# EAGLE design MasterBoard (EAGLE 9.4.2)
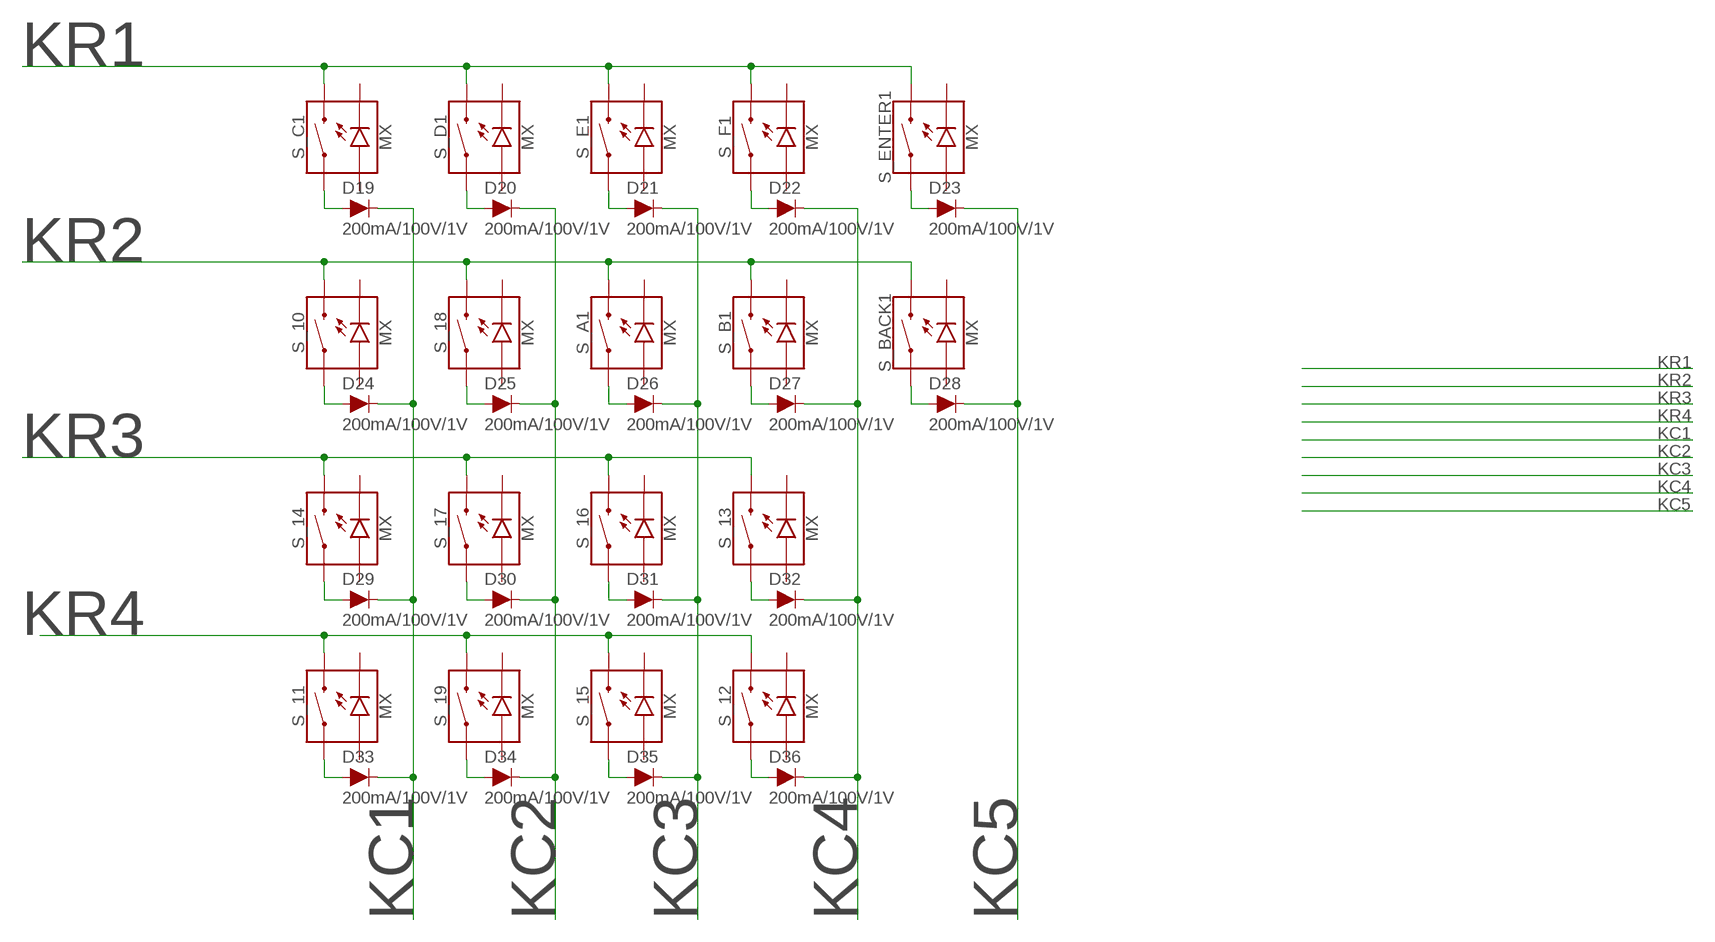
[diagram p0: schematic, sheet 1, part 1 of 2]
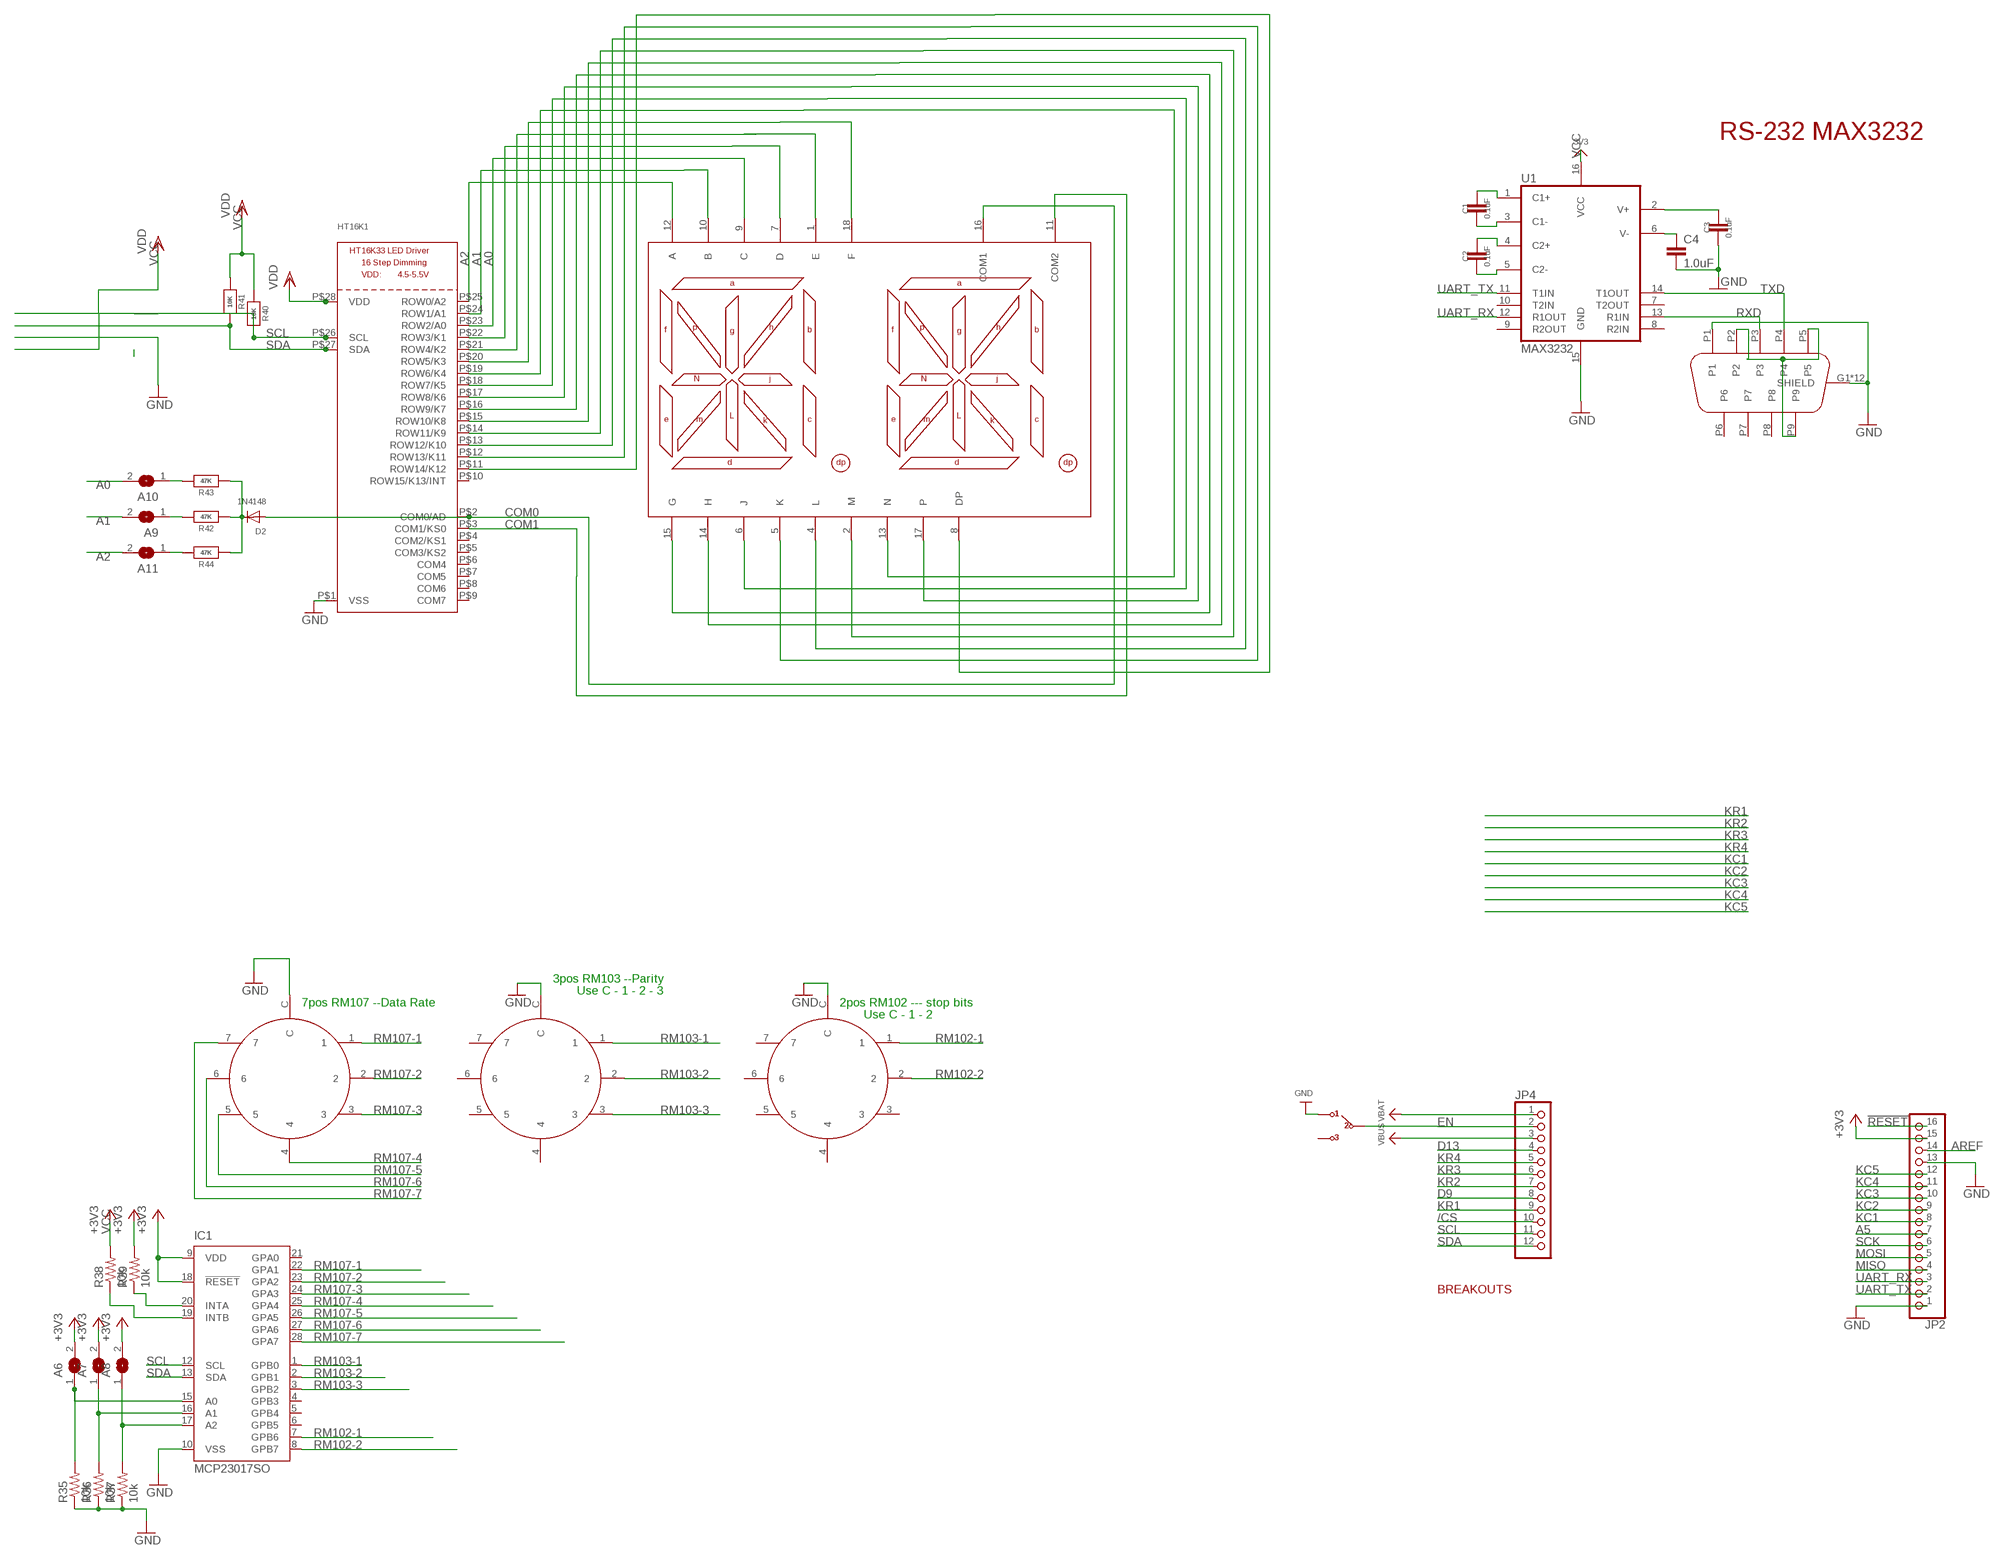
[diagram p1: schematic, sheet 1, part 2 of 2]

## Parts
A6  SJ  [SJ]
A7  SJ  [SJ]
A8  SJ  [SJ]
A9  SOLDERJUMPERREFLOW_NOPASTE  [SOLDERJUMPER_REFLOW_NOPASTE]
A10  SOLDERJUMPERREFLOW_NOPASTE  [SOLDERJUMPER_REFLOW_NOPASTE]
A11  SOLDERJUMPERREFLOW_NOPASTE  [SOLDERJUMPER_REFLOW_NOPASTE]
C1  0.1uF  1.0UF-0805-25V-10%  [0805]
C2  0.1uF  1.0UF-0805-25V-10%  [0805]
C3  0.1uF  1.0UF-0805-25V-10%  [0805]
C4  1.0uF  1.0UF-0805-25V-10%  [0805]
D2  1N4148  DIODESOD-323F  [SOD-323F]
D19  200mA/100V/1V  DIODE-1N4148  [DIODE-1N4148]
D20  200mA/100V/1V  DIODE-1N4148  [DIODE-1N4148]
D21  200mA/100V/1V  DIODE-1N4148  [DIODE-1N4148]
D22  200mA/100V/1V  DIODE-1N4148  [DIODE-1N4148]
D23  200mA/100V/1V  DIODE-1N4148  [DIODE-1N4148]
D24  200mA/100V/1V  DIODE-1N4148  [DIODE-1N4148]
D25  200mA/100V/1V  DIODE-1N4148  [DIODE-1N4148]
D26  200mA/100V/1V  DIODE-1N4148  [DIODE-1N4148]
D27  200mA/100V/1V  DIODE-1N4148  [DIODE-1N4148]
D28  200mA/100V/1V  DIODE-1N4148  [DIODE-1N4148]
D29  200mA/100V/1V  DIODE-1N4148  [DIODE-1N4148]
D30  200mA/100V/1V  DIODE-1N4148  [DIODE-1N4148]
D31  200mA/100V/1V  DIODE-1N4148  [DIODE-1N4148]
D32  200mA/100V/1V  DIODE-1N4148  [DIODE-1N4148]
D33  200mA/100V/1V  DIODE-1N4148  [DIODE-1N4148]
D34  200mA/100V/1V  DIODE-1N4148  [DIODE-1N4148]
D35  200mA/100V/1V  DIODE-1N4148  [DIODE-1N4148]
D36  200mA/100V/1V  DIODE-1N4148  [DIODE-1N4148]
DE9FEMALE1  EDGEMOUNTDE9  [DE09S065TLF]
HT16K1  HT16K33_SOP28_SKINNY  [SOP28_300MIL_SKINNY]
IC1  MCP23017SO  [SO28W]
JP2  HEADER-1X16ROUND  [1X16_ROUND]
JP4  HEADER-1X12  [1X12_ROUND]
R35  10k  R-US_M0805  [M0805]
R36  10k  R-US_M0805  [M0805]
R37  10k  R-US_M0805  [M0805]
R38  10k  R-US_M0805  [M0805]
R39  10k  R-US_M0805  [M0805]
R40  10K  RESISTOR0805_NOOUTLINE  [0805-NO]
R41  10K  RESISTOR0805_NOOUTLINE  [0805-NO]
R42  47K  RESISTOR0805_NOOUTLINE  [0805-NO]
R43  47K  RESISTOR0805_NOOUTLINE  [0805-NO]
R44  47K  RESISTOR0805_NOOUTLINE  [0805-NO]
S_10  MX  MOMENTARY-SWITCH-SPST-LED-PTH-CHERRY  [CHERRY-MX-LED]
S_11  MX  MOMENTARY-SWITCH-SPST-LED-PTH-CHERRY  [CHERRY-MX-LED]
S_12  MX  MOMENTARY-SWITCH-SPST-LED-PTH-CHERRY  [CHERRY-MX-LED]
S_13  MX  MOMENTARY-SWITCH-SPST-LED-PTH-CHERRY  [CHERRY-MX-LED]
S_14  MX  MOMENTARY-SWITCH-SPST-LED-PTH-CHERRY  [CHERRY-MX-LED]
S_15  MX  MOMENTARY-SWITCH-SPST-LED-PTH-CHERRY  [CHERRY-MX-LED]
S_16  MX  MOMENTARY-SWITCH-SPST-LED-PTH-CHERRY  [CHERRY-MX-LED]
S_17  MX  MOMENTARY-SWITCH-SPST-LED-PTH-CHERRY  [CHERRY-MX-LED]
S_18  MX  MOMENTARY-SWITCH-SPST-LED-PTH-CHERRY  [CHERRY-MX-LED]
S_19  MX  MOMENTARY-SWITCH-SPST-LED-PTH-CHERRY  [CHERRY-MX-LED]
S_A1  MX  MOMENTARY-SWITCH-SPST-LED-PTH-CHERRY  [CHERRY-MX-LED]
S_B1  MX  MOMENTARY-SWITCH-SPST-LED-PTH-CHERRY  [CHERRY-MX-LED]
S_BACK1  MX  MOMENTARY-SWITCH-SPST-LED-PTH-CHERRY  [CHERRY-MX-LED]
S_C1  MX  MOMENTARY-SWITCH-SPST-LED-PTH-CHERRY  [CHERRY-MX-LED]
S_D1  MX  MOMENTARY-SWITCH-SPST-LED-PTH-CHERRY  [CHERRY-MX-LED]
S_E1  MX  MOMENTARY-SWITCH-SPST-LED-PTH-CHERRY  [CHERRY-MX-LED]
S_ENTER1  MX  MOMENTARY-SWITCH-SPST-LED-PTH-CHERRY  [CHERRY-MX-LED]
S_F1  MX  MOMENTARY-SWITCH-SPST-LED-PTH-CHERRY  [CHERRY-MX-LED]
U1  MAX3232  MAX2323SOIC16  [SO16]
U$11  BIG14SEG  [HDSP]
U$12  RM107772BCB  [RM107772BCB]
U$15  OS102011MA1QN1  [OS102011MA1QN1]
U$17  RM107772BCB  [RM107772BCB]
U$18  RM107772BCB  [RM107772BCB]

## Nets
!RESET: JP2.16
/CS: JP4.10
A0: A10.2 HT16K1.P$23(ROW2/A0) U$11.9(C)
A1: A9.2 HT16K1.P$24(ROW1/A1) U$11.10(B)
A2: A11.2 HT16K1.P$25(ROW0/A2) U$11.12(A)
A5: JP2.7
AREF: JP2.14
COM0: D2.A HT16K1.P$2(COM0/AD) U$11.16(COM1)
COM1: HT16K1.P$3(COM1/KS0) U$11.11(COM2)
D9: JP4.8
D13: JP4.4
EN: JP4.2 U$15.P$2
GND: C3.2 C4.2 DE9FEMALE1.G1(SHIELD) DE9FEMALE1.G2(SHIELD) DE9FEMALE1.G3(SHIELD) DE9FEMALE1.G4(SHIELD) DE9FEMALE1.G5(SHIELD) DE9FEMALE1.G6(SHIELD) DE9FEMALE1.G7(SHIELD) DE9FEMALE1.G8(SHIELD) DE9FEMALE1.G9(SHIELD) DE9FEMALE1.G10(SHIELD) DE9FEMALE1.G11(SHIELD) DE9FEMALE1.G12(SHIELD) DE9FEMALE1.P1 HT16K1.P$1(VSS) IC1.10(VSS) JP2.1 JP2.13 R35.1 R36.1 R37.1 U1.15(GND) U$12.C U$15.P$1 U$17.C U$18.C
KC1: D19.C D24.C D29.C D33.C JP2.8
KC2: D20.C D25.C D30.C D34.C JP2.9
KC3: D21.C D26.C D31.C D35.C JP2.10
KC4: D22.C D27.C D32.C D36.C JP2.11
KC5: D23.C D28.C JP2.12
KR1: JP4.9 S_C1.S2 S_D1.S2 S_E1.S2 S_ENTER1.S2 S_F1.S2
KR2: JP4.7 S_10.S2 S_18.S2 S_A1.S2 S_B1.S2 S_BACK1.S2
KR3: JP4.6 S_13.S2 S_14.S2 S_16.S2 S_17.S2
KR4: JP4.5 S_11.S2 S_12.S2 S_15.S2 S_19.S2
MISO: JP2.4
MOSI: JP2.5
N$1: D33.A S_11.S1
N$2: D34.A S_19.S1
N$3: D35.A S_15.S1
N$4: D36.A S_12.S1
N$23: D29.A S_14.S1
N$24: D30.A S_17.S1
N$25: D31.A S_16.S1
N$26: D32.A S_13.S1
N$27: D24.A S_10.S1
N$28: D25.A S_18.S1
N$29: D26.A S_A1.S1
N$30: D27.A S_B1.S1
N$31: D28.A S_BACK1.S1
N$32: D23.A S_ENTER1.S1
N$33: D22.A S_F1.S1
N$34: D21.A S_E1.S1
N$35: D20.A S_D1.S1
N$36: D19.A S_C1.S1
N$50: C1.2 U1.3(C1-)
N$51: C1.1 U1.1(C1+)
N$52: C2.1 U1.4(C2+)
N$53: C2.2 U1.5(C2-)
N$54: C3.1 U1.2(V+)
N$55: C4.1 U1.6(V-)
N$56: DE9FEMALE1.P2 DE9FEMALE1.P5 DE9FEMALE1.P9
N$57: A6.1 IC1.15(A0) R35.2
N$58: A7.1 IC1.16(A1) R36.2
N$59: A8.1 IC1.17(A2) R37.2
N$60: IC1.19(INTB) R38.1
N$61: IC1.20(INTA) R39.1
N$62: A9.1 R42.2
N$63: A10.1 R43.2
N$64: HT16K1.P$22(ROW3/K1) U$11.7(D)
N$65: HT16K1.P$21(ROW4/K2) U$11.1(E)
N$66: HT16K1.P$20(ROW5/K3) U$11.18(F)
N$67: HT16K1.P$19(ROW6/K4) U$11.13(N)
N$68: HT16K1.P$18(ROW7/K5) U$11.6(J)
N$69: D2.C R42.1 R43.1 R44.1
N$70: A11.1 R44.2
N$71: HT16K1.P$17(ROW8/K6) U$11.17(P)
N$72: HT16K1.P$16(ROW9/K7) U$11.15(G)
N$73: HT16K1.P$15(ROW10/K8) U$11.14(H)
N$74: HT16K1.P$14(ROW11/K9) U$11.2(M)
N$75: HT16K1.P$13(ROW12/K10) U$11.4(L)
N$76: HT16K1.P$12(ROW13/K11) U$11.5(K)
N$77: HT16K1.P$11(ROW14/K12) U$11.8(DP)
RM102-1: IC1.7(GPB6) U$18.1
RM102-2: IC1.8(GPB7) U$18.2
RM103-1: IC1.1(GPB0) U$17.1
RM103-2: IC1.2(GPB1) U$17.2
RM103-3: IC1.3(GPB2) U$17.3
RM107-1: IC1.22(GPA1) U$12.1
RM107-2: IC1.23(GPA2) U$12.2
RM107-3: IC1.24(GPA3) U$12.3
RM107-4: IC1.25(GPA4) U$12.4
RM107-5: IC1.26(GPA5) U$12.5
RM107-6: IC1.27(GPA6) U$12.6
RM107-7: IC1.28(GPA7) U$12.7
RXD: DE9FEMALE1.P3 U1.13(R1IN)
SCK: JP2.6
SCL: HT16K1.P$26(SCL) IC1.12(SCL) JP4.11 R40.2
SDA: HT16K1.P$27(SDA) IC1.13(SDA) JP4.12 R41.2
TXD: DE9FEMALE1.P4 U1.14(T1OUT)
UART_RX: JP2.3 U1.12(R1OUT)
UART_TX: JP2.2 U1.11(T1IN)
VBAT: JP4.1
VBUS: JP4.3
VCC: A6.2 A7.2 A8.2 HT16K1.P$28(VDD) IC1.9(VDD) IC1.18(!RESET) JP2.15 R38.2 R39.2 R40.1 R41.1 U1.16(VCC) ; supply symbol labelled VDD, 3V3, +3V3
Unconnected: DE9FEMALE1.P6 DE9FEMALE1.P7 DE9FEMALE1.P8 HT16K1.P$4(COM2/KS1) HT16K1.P$5(COM3/KS2) HT16K1.P$6(COM4) HT16K1.P$7(COM5) HT16K1.P$8(COM6) HT16K1.P$9(COM7) HT16K1.P$10(ROW15/K13/INT) IC1.4(GPB3) IC1.5(GPB4) IC1.6(GPB5) IC1.21(GPA0) S_10.A S_10.K(C) S_11.A S_11.K(C) S_12.A S_12.K(C) S_13.A S_13.K(C) S_14.A S_14.K(C) S_15.A S_15.K(C) S_16.A S_16.K(C) S_17.A S_17.K(C) S_18.A S_18.K(C) S_19.A S_19.K(C) S_A1.A S_A1.K(C) S_B1.A S_B1.K(C) S_BACK1.A S_BACK1.K(C) S_C1.A S_C1.K(C) S_D1.A S_D1.K(C) S_E1.A S_E1.K(C) S_ENTER1.A S_ENTER1.K(C) S_F1.A S_F1.K(C) U1.7(T2OUT) U1.8(R2IN) U1.9(R2OUT) U1.10(T2IN) U$15.CASE1(CASE) U$15.CASE2(CASE) U$15.P$3 U$17.4 U$17.5 U$17.6 U$17.7 U$18.3 U$18.4 U$18.5 U$18.6 U$18.7

## Notes on the sheet
- RS-232 MAX3232
- 3pos RM103 --Parity
- Use C - 1 - 2 - 3
- 7pos RM107 --Data Rate | 2pos RM102 --- stop bits
- Use C - 1 - 2
- BREAKOUTS

## Library data of the parts
A6-A8 = jumper:SJ: SMD solder JUMPER
A9-A11 = microbuilder:SOLDERJUMPER: SMD Solder JUMPER Solder the two pads together to create a connection, or remove the solder to break it. REFLOW - Use this footprint for solder paste and reflow ovens. WAVE - Use this footprint for hand-soldering (larger pads). CLOSED - Has a trace between the two pads to ensure it is closed by default. The trace needs to be cut to disable the jumper, and can be closed again by creating a solder bridge between the two pads.
C1-C3 = SparkFun-Capacitors:1.0UF: 1µF ceramic capacitors A capacitor is a passive two-terminal electrical component used to store electrical energy temporarily in an electric field.; PROD_ID: CAP-08064; VALUE: 1.0uF
C4 = SparkFun-Capacitors:1.0UF: 1µF ceramic capacitors A capacitor is a passive two-terminal electrical component used to store electrical energy temporarily in an electric field.; PROD_ID: CAP-08064
D2 = adafruit:DIODE: Diode
D19-D36 = SparkFun-DiscreteSemi:DIODE: Diode; PROD_ID: DIO-08378
DE9FEMALE1 = Serial:EDGEMOUNTDE9
HT16K1 = microbuilder:HT16K33_SOP28
IC1 = adafruit:MCP23017: http://ww1.microchip.com/downloads/en/DeviceDoc/21952a.pdf Source: http://ww1.microchip.com/downloads/en/DeviceDoc/21952a.pdf
JP2 = microbuilder:HEADER-1X16: PIN HEADER
JP4 = microbuilder:HEADER-1X12
R35-R39 = resistor:R-US_: RESISTOR, American symbol
R40-R44 = microbuilder:RESISTOR: Resistors For new designs, use the packages preceded by an '_' character since they are more reliable: The following footprints should be used on most boards: _0402 - Standard footprint for regular board layouts _0603 - Standard footprint for regular board layouts _0805 - Standard footprint for regular board layouts _1206 - Standard footprint for regular board layouts For extremely tight-pitch boards where space is at a premium, the following 'micro-pitch' footprints can be used (smaller pads, no silkscreen outline, etc.): _0402MP - Micro-pitch footprint for very dense/compact boards _0603MP - Micro-pitch footprint for very dense/compact boards _0805MP - Micro-pitch footprint for very dense/compact boards _1206MP - Micro-pitch footprint for very dense/compact boards
S_10-S_19 S_A1 S_B1 S_BACK1 S_C1 S_D1 S_E1 S_ENTER1 S_F1 = SparkFun-Switches:MOMENTARY-SWITCH-SPST-LED: Momentary Switch (Pushbutton) - SPST - w/ LED Normally-open (NO) SPST momentary switches (buttons, pushbuttons), with a built-in LED. Variants PTH-CHERRY - Cherry MX Switch Cherry MX Keyswitches are top-of-the-line mechanical keyboard switches. They’re satisfyingly “clicky”, reliable up to tens-of-millions of key presses, and a standard in gaming and programming keyboards across the globe. This ‘blue’ version Cherry MX Switch is favored by most due to its secondary internal actuator making it less likely to “double-tap.” If you are looking for a noticeably audible and high-quality key switch, this is the perfect option for you! Cherry MX Switch <https://www.sparkfun.com/products/13834> (COM-13834) Cherry MX Switch Breakout <https://www.sparkfun.com/products/13773> (BOB-13773) PTH-12MM and PTH-12MM-KIT - 12mm Illuminated LED KIT variant is for soldering kits. There is no tStop (covering up the top side of the pads with mask). This helps the beginner see which side they should be soldering too. LED Tactile Button Breakout <https://www.sparkfun.com/products/10467> (BOB-10467) LED Tactile Button - Red <https://www.sparkfun.com/products/10442> (COM-10442) LED Tactile Button - Blue <https://www.sparkfun.com/products/10443> (COM-10443) LED Tactile Button - Green <https://www.sparkfun.com/products/10440> (COM-10440) LED Tactile Button - Orange <https://www.sparkfun.com/products/10441> (COM-10441) LED Tactile Button - White <https://www.sparkfun.com/products/10439> (COM-10439); SF_ID: COM-13834
U1 = SparkFun-IC-Comms:MAX2323: RS232 Transceiver This part covers 232 drivers that are compatible with the MAX3232. Sipex SP3232EB Datasheet <http://cdn.sparkfun.com/datasheets/Components/General%20IC/SP3232EBCA-L.pdf> SparkFun Products SOIC component <https://www.sparkfun.com/products/589> (COM-00589 / IC-08171) Retired DIP component (COM-00316 / IC-08446) SparkFun Transceiver Breakout - MAX3232 <https://www.sparkfun.com/products/11189> (BOB-11189) SparkFun XBee Explorer Serial <https://www.sparkfun.com/products/13225> (WRL-13225); PROD_ID: IC-08171
U$11 = Segment displays:BIG14SEG
U$12 U$17 U$18 = Segment displays:RM107772BCB
U$15 = FPC:OS102011MA1QN1

## Board
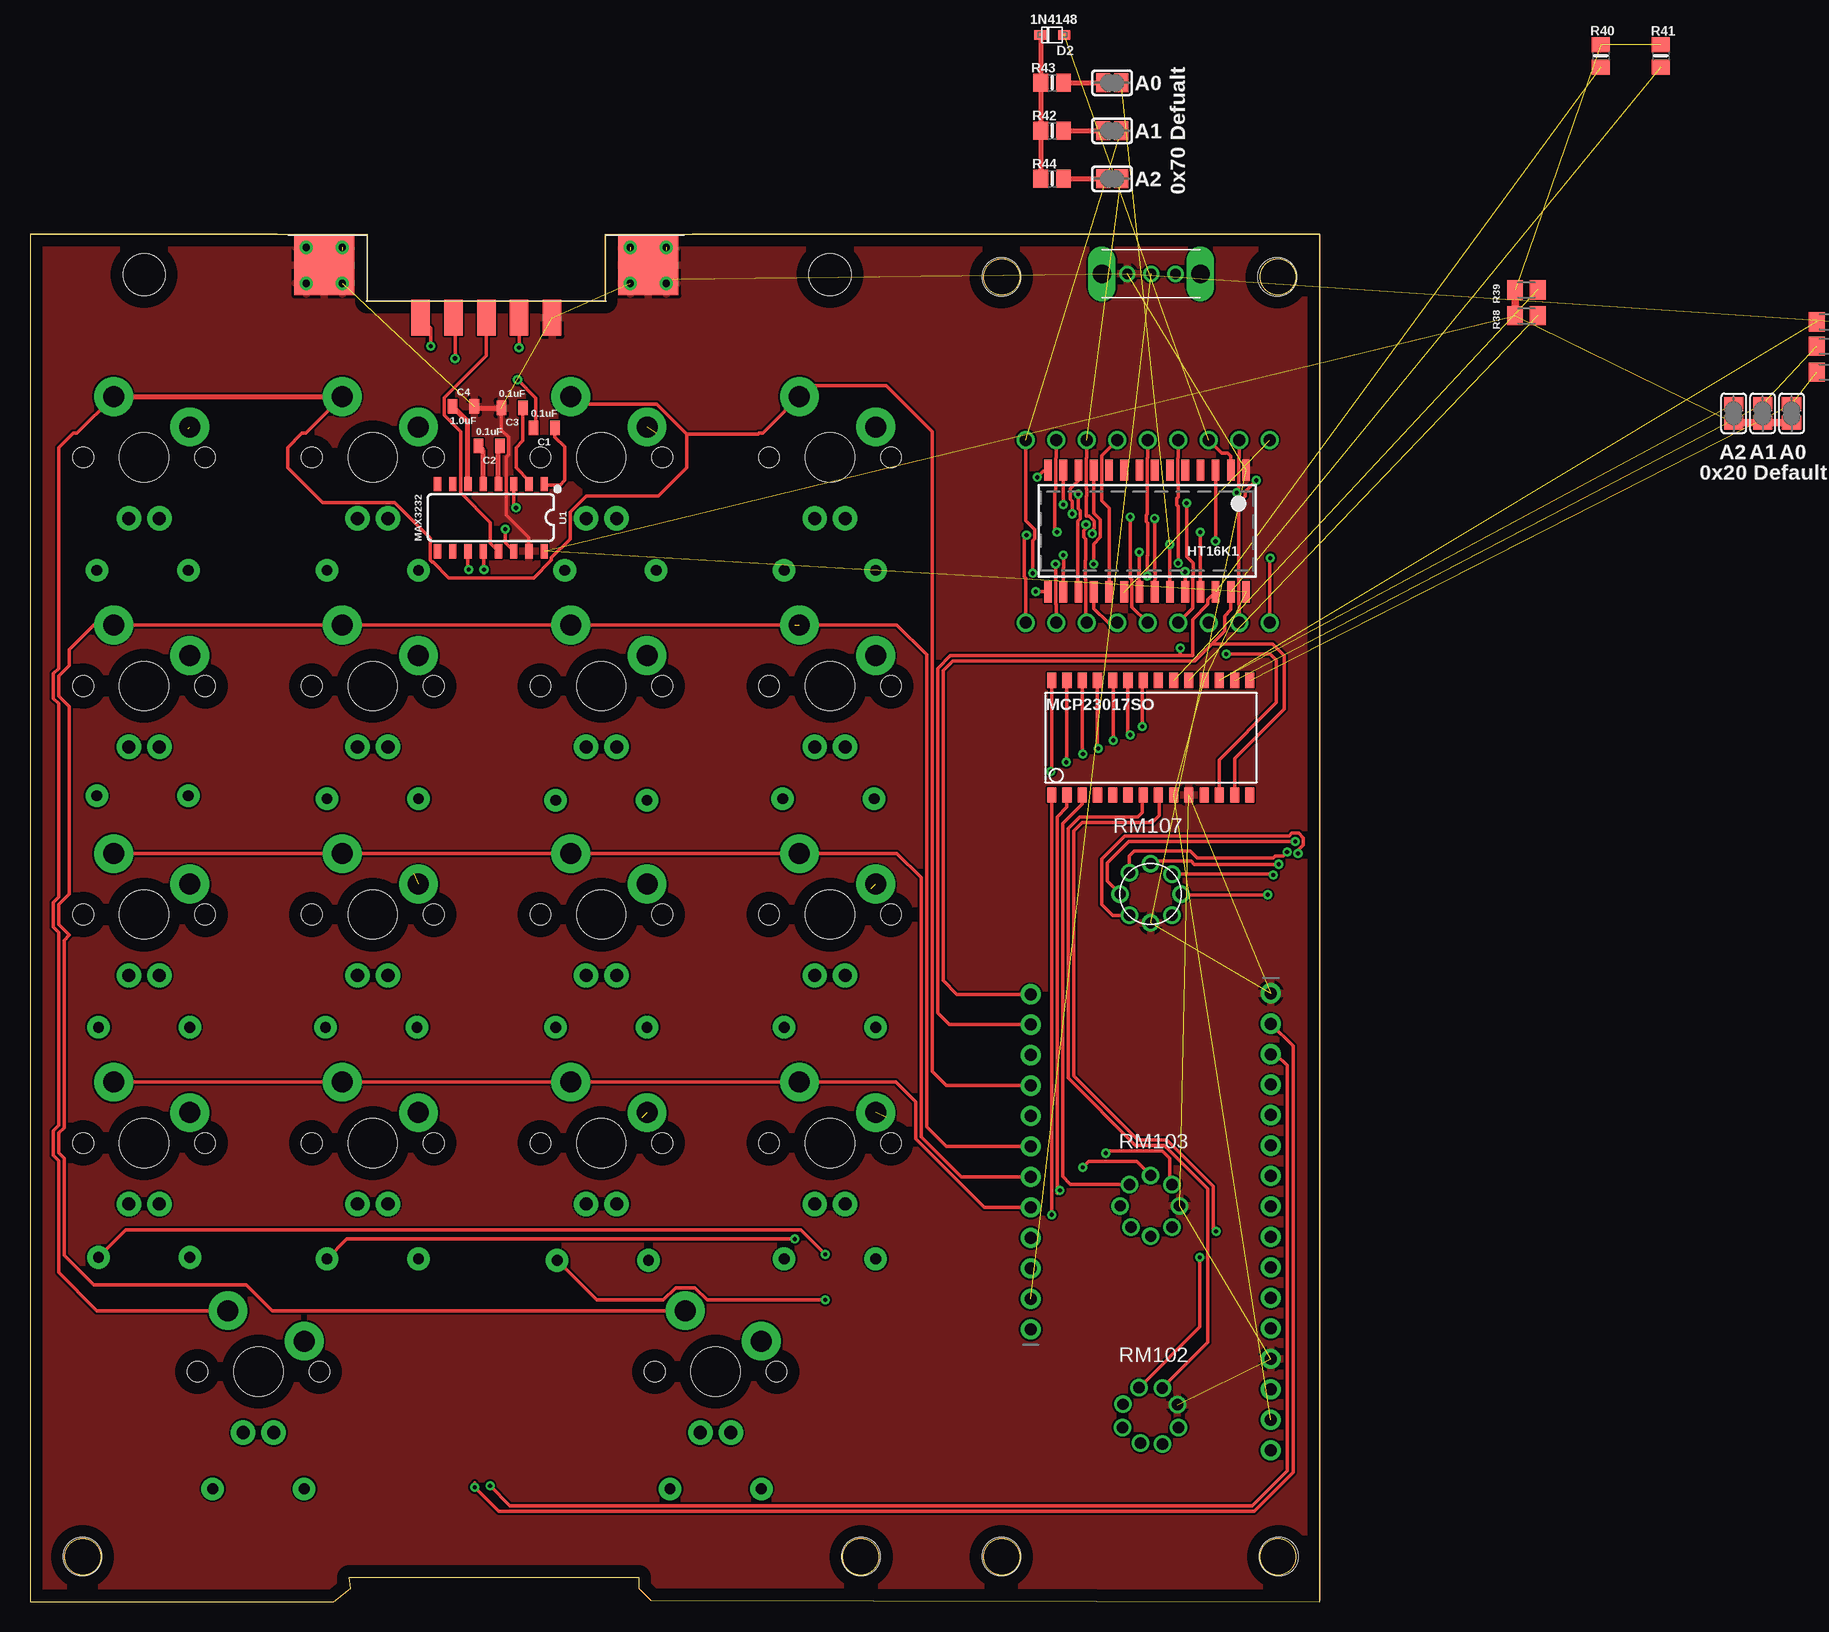
[diagram p2: board, top side]
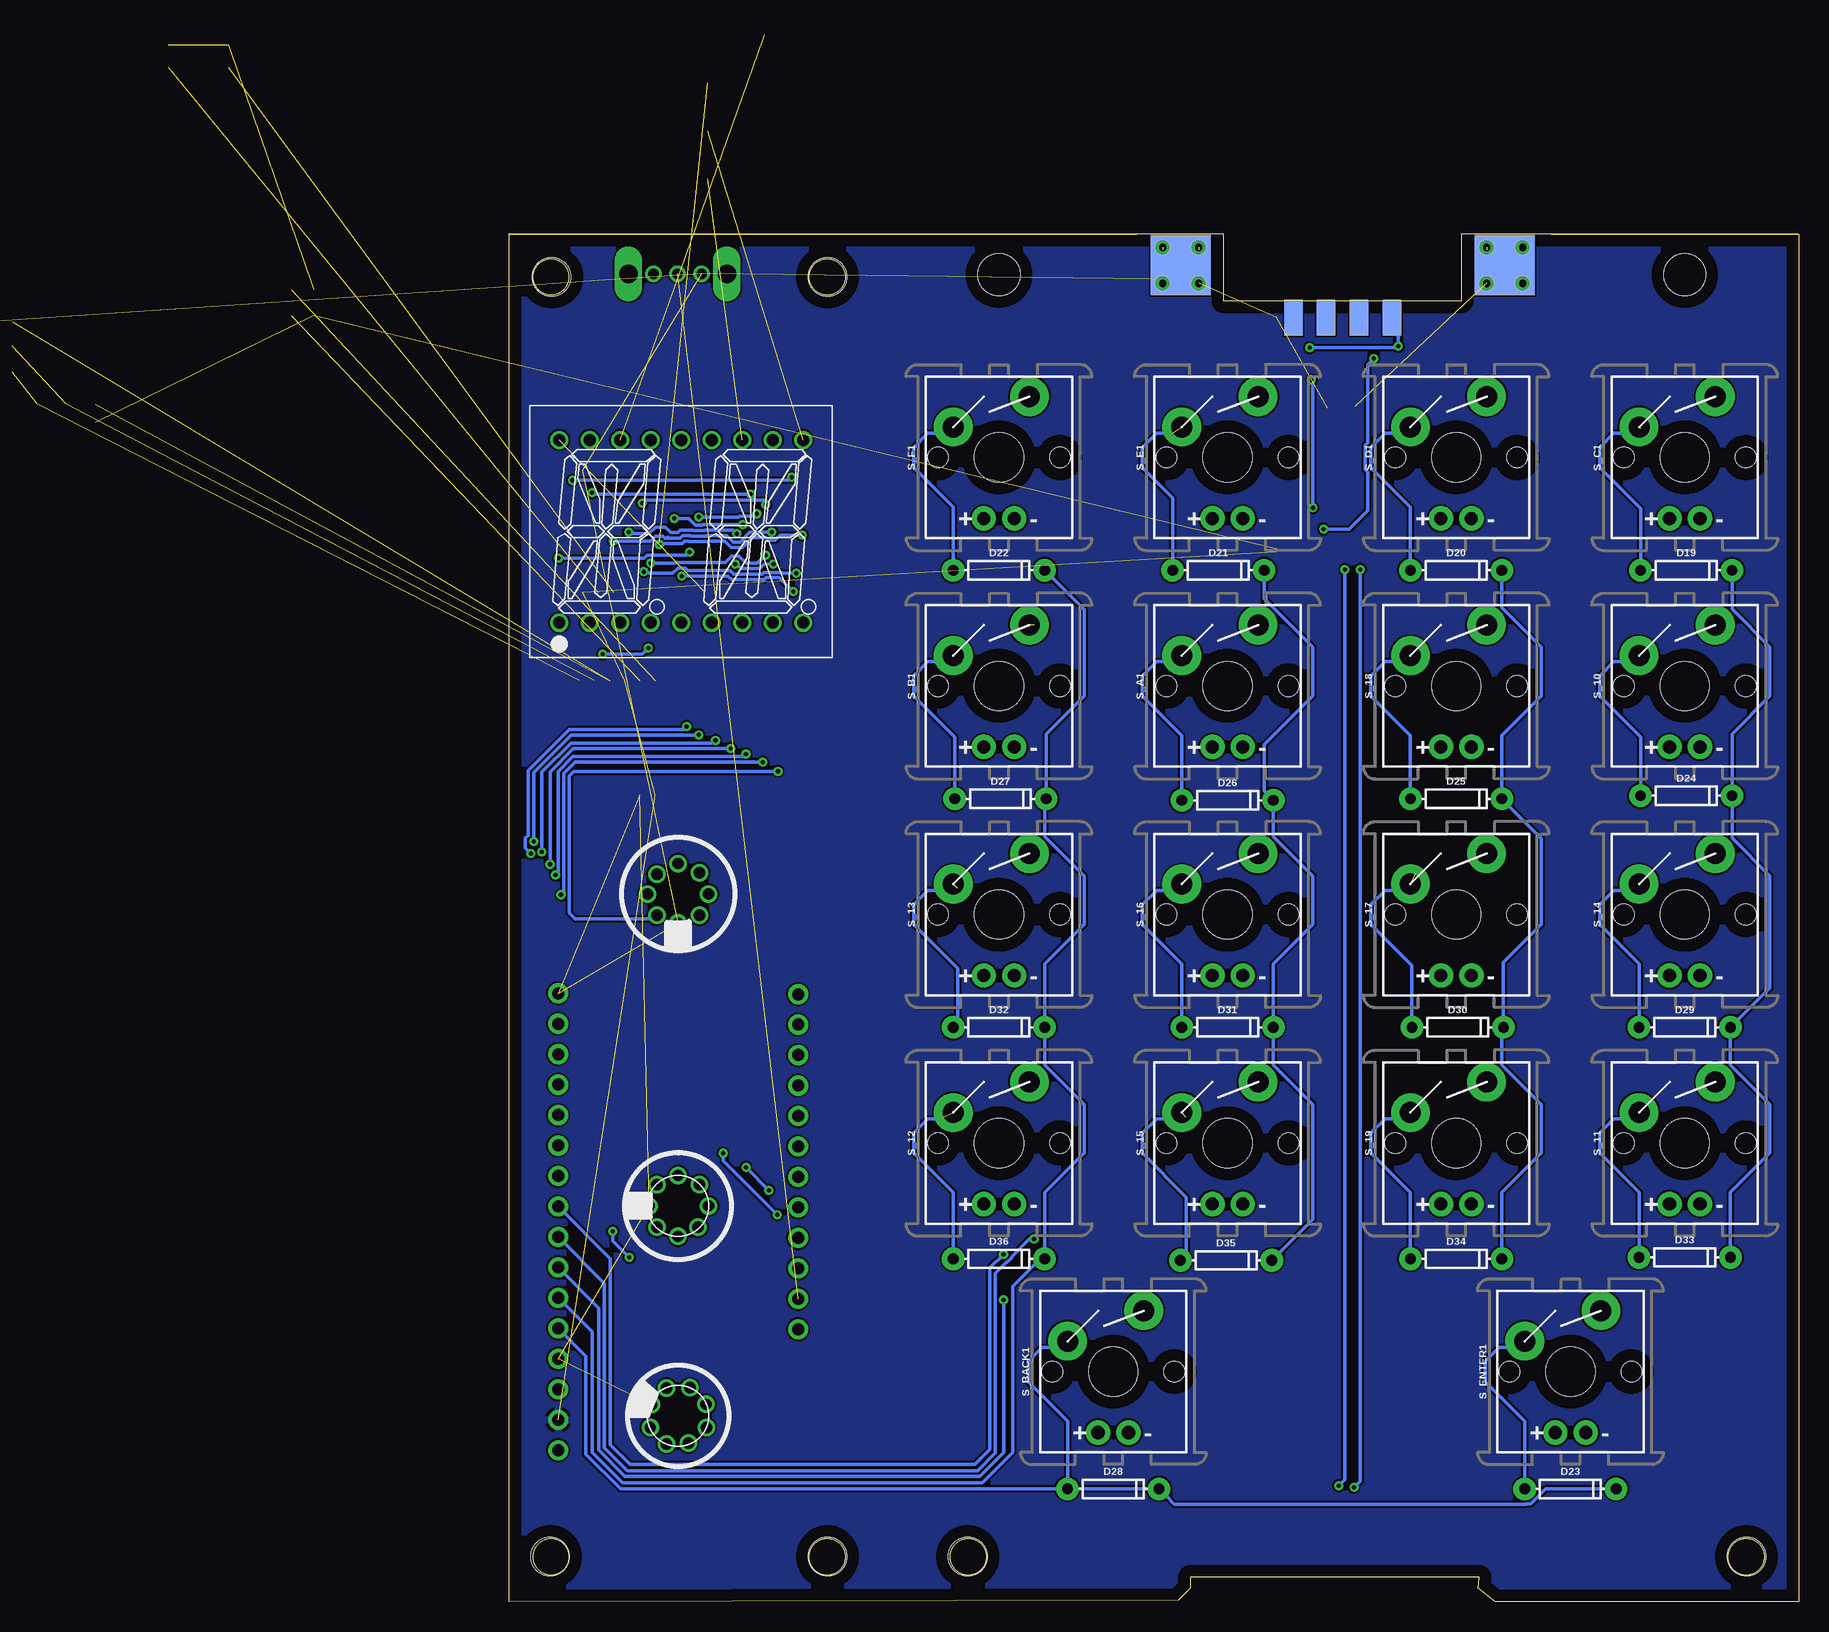
[diagram p3: board, bottom side, seen from below]

Size 107.47 x 114 mm. Coordinates in mm from the lower left corner, seen from the top.
Outline: 0,0 4.21,0 25.31,0 26.72,1.11 26.62,2.03 50.62,2.03 50.72,2.03 50.72,1.11 51.72,0.11 107.47,0 107.47,114 55.17,114 47.93,114 47.93,108.41 28.12,108.41 28.12,114 20.62,114 0,114 0,0
Outline: circle at 4.39,3.76 radius 1.5
Outline: circle at 69.22,3.76 radius 1.5
Outline: circle at 80.97,110.44 radius 1.5
Outline: circle at 103.99,110.44 radius 1.5
Outline: circle at 80.97,3.76 radius 1.5
Outline: circle at 103.99,3.76 radius 1.5
Copper layers (1*16): Top 0.035mm / dielectric 1.5mm / Bottom 0.035mm
Design rules "default": minimum track width 6mil, minimum drill 0.35mm, track to track 6mil, track to pad 6mil, pad to pad 6mil, via to via 6mil, smd to smd 6mil, copper to edge 40mil, drill to drill 6mil, minimum pad ring 10mil, minimum via ring 8mil, stop-mask expansion 4mil, vias tented up to drill 0mil, thermal gap 10mil
Holes 3.5 mm at 9.51,110.63 66.66,110.63
Holes 3.2 mm at 80.95,110.44 103.93,110.44 104.06,3.76 80.95,3.76 69.26,3.76 4.37,3.76
Milling: 8 lines

### Footprints (pad centres in the part's own frame; a part is rotated, then mirrored left to right if it is on the bottom)
SJ = smd 1.168 x 1.6: 1 -0.762,0; 2 0.762,0
SOLDERJUMPER_REFLOW_NOPASTE = smd 1.168 x 1.6: 1 -0.762,0; 2 0.762,0
0805 = smd 0.8 x 1.2: 1 -0.9,0; 2 0.9,0
SOD-323F = smd 1 x 0.8: A -1,0; C 1,0
DIODE-1N4148 = drill 0.9 pad 1.88: A -3.81,0; C 3.81,0
DE09S065TLF = drill 0.6: G1 -15,4.5; G2 -12,4.5; G3 -15,1.5; G4 -12,1.5; G5 12,4.5; G6 15,4.5; G7 12,1.5; G8 15,1.5 | smd 5 x 5 bottom: G9 13.5,3; G10 -13.5,3 | smd 5 x 5: G11 -13.5,3; G12 13.5,3 | smd 1.54 x 3: P1 5.48,-1.37; P2 2.74,-1.37; P3 0,-1.37; P4 -2.74,-1.37; P5 -5.48,-1.37 | smd 1.54 x 3 bottom: P6 4.11,-1.37; P7 1.37,-1.37; P8 -1.37,-1.37; P9 -4.11,-1.37
SOP28_300MIL_SKINNY = smd 0.635 x 1.778: P$1 -8.255,-5.08; P$2 -6.985,-5.08; P$3 -5.715,-5.08; P$4 -4.445,-5.08; P$5 -3.175,-5.08; P$6 -1.905,-5.08; P$7 -0.635,-5.08; P$8 0.635,-5.08; P$9 1.905,-5.08; P$10 3.175,-5.08; P$11 4.445,-5.08; P$12 5.715,-5.08; P$13 6.985,-5.08; P$14 8.255,-5.08; P$15 8.255,5.08; P$16 6.985,5.08; P$17 5.715,5.08; P$18 4.445,5.08; P$19 3.175,5.08; P$20 1.905,5.08; P$21 0.635,5.08; P$22 -0.635,5.08; P$23 -1.905,5.08; P$24 -3.175,5.08; P$25 -4.445,5.08; P$26 -5.715,5.08; P$27 -6.985,5.08; P$28 -8.255,5.08
SO28W = smd 0.762 x 1.27: 1 -7.62,-4.78; 2 -6.35,-4.78; 3 -5.08,-4.78; 4 -3.81,-4.78; 5 -2.54,-4.78; 6 -1.27,-4.78; 7 0,-4.78; 8 1.27,-4.78; 9 2.54,-4.78; 10 3.81,-4.78; 11 5.08,-4.78; 12 6.35,-4.78; 13 7.62,-4.78; 14 8.89,-4.78; 15 8.89,4.78; 16 7.62,4.78; 17 6.35,4.78; 18 5.08,4.78; 19 3.81,4.78; 20 2.54,4.78; 21 1.27,4.78; 22 0,4.78; 23 -1.27,4.78; 24 -2.54,4.78; 25 -3.81,4.78; 26 -5.08,4.78; 27 -6.35,4.78; 28 -7.62,4.78
1X16_ROUND = drill 1 pad 1.676: 1 -19.05,0; 2 -16.51,0; 3 -13.97,0; 4 -11.43,0; 5 -8.89,0; 6 -6.35,0; 7 -3.81,0; 8 -1.27,0; 9 1.27,0; 10 3.81,0; 11 6.35,0; 12 8.89,0; 13 11.43,0; 14 13.97,0; 15 16.51,0; 16 19.05,0
1X12_ROUND = drill 1 pad 1.676: 1 -13.97,0; 2 -11.43,0; 3 -8.89,0; 4 -6.35,0; 5 -3.81,0; 6 -1.27,0; 7 1.27,0; 8 3.81,0; 9 6.35,0; 10 8.89,0; 11 11.43,0; 12 13.97,0
M0805 = smd 1.3 x 1.6: 1 -0.95,0; 2 0.95,0
0805-NO = smd 1.24 x 1.5: 1 -0.95,0; 2 0.95,0
CHERRY-MX-LED = drill 1.092 pad 2.032: A -1.27,-5.08; K 1.27,-5.08 | drill 1.753 pad 3.226: S1 -3.81,2.54; S2 2.54,5.08 | hole 4.089: 0,0 | hole 1.707: -5.08,0; 5.08,0
SO16 = smd 0.6 x 1.2: 1 -4.445,-2.8; 2 -3.175,-2.8; 3 -1.905,-2.8; 4 -0.635,-2.8; 5 0.635,-2.8; 6 1.905,-2.8; 7 3.175,-2.8; 8 4.445,-2.8; 9 4.445,2.8; 10 3.175,2.8; 11 1.905,2.8; 12 0.635,2.8; 13 -0.635,2.8; 14 -1.905,2.8; 15 -3.175,2.8; 16 -4.445,2.8
HDSP = drill 1: 1 -10.16,-7.62; 2 -7.62,-7.62; 3 -5.08,-7.62; 4 -2.54,-7.62; 5 0,-7.62; 6 2.54,-7.62; 7 5.08,-7.62; 8 7.62,-7.62; 9 10.16,-7.62; 10 10.16,7.62; 11 7.62,7.62; 12 5.08,7.62; 13 2.54,7.62; 14 0,7.62; 15 -2.54,7.62; 16 -5.08,7.62; 17 -7.62,7.62; 18 -10.16,7.62
RM107772BCB = drill 0.95: 1 1.778,1.778; 2 2.54,0; 3 1.778,-1.778; 4 0,-2.54; 5 -1.778,-1.651; 6 -2.54,0; 7 -1.778,1.778; C 0,2.413
OS102011MA1QN1 = drill 1.524 pad 2 long: CASE1 0,0; CASE2 8.204,0 | drill 0.85 pad 1.27: P$1 2.108,0; P$2 4.115,0; P$3 6.121,0

### Placement (x,y rotation side)
A6  146.8,99.07 270 top  (outside the outline)
A7  144.39,99.07 270 top  (outside the outline)
A8  141.97,99.07 270 top  (outside the outline)
A9  90.18,122.62 0 top  (outside the outline)
A10  90.18,126.62 0 top  (outside the outline)
A11  90.18,118.62 0 top  (outside the outline)
C1  42.85,97.87 180 top
C2  38.28,96.34 180 top
C3  40.18,99.52 180 top
C4  36.12,99.65 0 top
D2  85.18,130.62 180 top  (outside the outline)
D19  9.38,85.99 0 bottom
D20  28.56,85.99 0 bottom
D21  48.37,85.99 0 bottom
D22  66.66,85.99 0 bottom
D23  19.04,9.41 0 bottom
D24  9.38,67.2 0 bottom
D25  28.56,66.94 0 bottom
D26  47.61,66.82 0 bottom
D27  66.53,66.94 0 bottom
D28  57.14,9.41 0 bottom
D29  9.51,47.89 0 bottom
D30  28.43,47.89 0 bottom
D31  47.61,47.89 0 bottom
D32  66.66,47.89 0 bottom
D33  9.51,28.72 0 bottom
D34  28.56,28.59 0 bottom
D35  47.74,28.46 0 bottom
D36  66.66,28.59 0 bottom
DE9FEMALE1  38.02,108.41 0 top
HT16K1  93.09,89.26 180 top
IC1  92.77,72.03 0 top
JP2  103.4,31.68 270 top
JP4  83.4,36.68 90 top
R35  149.85,102.5 180 top  (outside the outline)
R36  149.85,104.66 180 top  (outside the outline)
R37  149.85,106.69 180 top  (outside the outline)
R38  124.7,107.2 180 top  (outside the outline)
R39  124.7,109.36 180 top  (outside the outline)
R40  130.9,128.86 270 top  (outside the outline)
R41  135.9,128.86 270 top  (outside the outline)
R42  85.18,122.62 0 top  (outside the outline)
R43  85.18,126.62 0 top  (outside the outline)
R44  85.18,118.62 0 top  (outside the outline)
S_10  9.51,76.34 0 bottom
S_11  9.51,38.24 0 bottom
S_12  66.66,38.24 0 bottom
S_13  66.66,57.29 0 bottom
S_14  9.51,57.29 0 bottom
S_15  47.61,38.24 0 bottom
S_16  47.61,57.29 0 bottom
S_17  28.56,57.29 0 bottom
S_18  28.56,76.34 0 bottom
S_19  28.56,38.24 0 bottom
S_A1  47.61,76.34 0 bottom
S_B1  66.66,76.34 0 bottom
S_BACK1  57.14,19.19 0 bottom
S_C1  9.51,95.39 0 bottom
S_D1  28.56,95.39 0 bottom
S_E1  47.61,95.39 0 bottom
S_ENTER1  19.04,19.19 0 bottom
S_F1  66.66,95.39 0 bottom
U1  38.4,90.38 180 top
U$11  93.14,89.23 0 bottom
U$12  93.39,59 180 top
U$15  89.33,110.69 0 top
U$17  93.39,33 90 bottom
U$18  93.39,15.5 67.5 bottom

### Tracks (layer width: path | path; a pad name or v marks a point on that pad's centre or on a via)
A0  (via drill 0.35)  (1 unrouted)
  Top 0.305: v94.98,88.15 94.98,84.2 HT16K1.P$23 | U$11.9 82.98,85.34 82.87,85.46 82.87,88.74 v83.04,88.91
  Bottom 0.305: v94.98,88.15 94.93,88.21 93.05,88.21 92.82,88.43 92.58,88.43 92.53,88.38 90.83,88.38 90.78,88.43 89.52,88.43 88.98,87.89 88.04,87.89 87.22,88.71 86.09,88.71 85.87,88.48 85.3,88.48 84.87,88.91 v83.04,88.91
A1  (via drill 0.35)  (1 unrouted)
  Top 0.305: U$11.10 82.98,90.12 83.73,89.37 83.73,88.63 83.55,88.46 v83.55,85.74 | v96.25,85.87 96.27,85.85 HT16K1.P$24
  Bottom 0.305: v96.25,85.87 96.12,85.74 93.82,85.74 93.38,86.19 92.81,86.19 92.58,85.96 89.06,85.96 88.75,85.66 86.4,85.66 86.24,85.82 84.76,85.82 84.68,85.74 v83.55,85.74
A2  (via drill 0.35)  (1 unrouted)
  Top 0.305: U$11.12 88.06,95.4 88.02,95.36 88.02,92.77 88.05,92.75 88.05,92.19 88.02,92.17 88.02,90.52 88.06,90.49 88.28,90.49 88.68,90.09 88.68,89.52 88.51,89.35 v88.51,89.03 | v97.52,89.17 97.52,84.2 HT16K1.P$25
  Bottom 0.305: v97.52,89.17 97.39,89.03 95.83,89.03 95.27,89.6 94.47,89.6 93.99,89.12 93.43,89.12 93.2,89.35 92.2,89.35 92.15,89.3 91.21,89.3 91.16,89.35 88.82,89.35 v88.51,89.03
COM0  (1 unrouted)
  Top 0.305: U$11.16 99.3,95.77 99.81,95.77 100.08,95.5 HT16K1.P$2
COM1  (via drill 0.35)
  Top 0.305: U$11.11 85.52,95.4 85.48,95.36 85.48,92.58 85.41,92.5 85.41,89.34 v85.58,89.17 | v98.79,88.41 98.79,94.33 HT16K1.P$3
  Bottom 0.305: 94.26,88.74 94.18,88.66 | v85.58,89.17 87.41,89.17 88.23,88.35 88.8,88.35 89.33,88.89 90.97,88.89 91.02,88.84 92.34,88.84 92.39,88.89 93.01,88.89 93.24,88.66 94.53,88.66 94.7,88.84 95.27,88.84 95.69,88.41 v98.79,88.41
EN  (1 unrouted)
GND  (17 unrouted)
  Top 0.305: C3.2 39.28,97.67 39.88,97.07 39.88,95.62 39.7,95.44 39.7,90.6 41.58,88.72 U1.15
  Top 0.406: C4.2 37.14,99.52 C3.2
  Top 0.61: DE9FEMALE1.G1 24.39,111.54 | 26.02,112.67 25.79,112.67 25.14,112.02 25.14,111.52 25.02,111.41 DE9FEMALE1.G10 | DE9FEMALE1.G10 24.52,110.4 24.03,109.91 DE9FEMALE1.G3 | DE9FEMALE1.G10 24.48,111.41 24.37,111.52 24.39,111.54 | DE9FEMALE1.G10 24.39,111.54 | DE9FEMALE1.G10 DE9FEMALE1.G4 | DE9FEMALE1.G9 51.15,111.41 49.89,112.67 49.77,112.67 | 53.02,112.67 52.79,112.67 | DE9FEMALE1.G9 52.42,111.41 53.58,110.25 53.24,109.91 DE9FEMALE1.G8 | DE9FEMALE1.G9 DE9FEMALE1.G7 | DE9FEMALE1.G9 51.52,110.73 51.04,110.25 51.04,110.93 DE9FEMALE1.G9 | DE9FEMALE1.G9 52.79,112.67 | 52.79,112.67 53.02,112.67 | DE9FEMALE1.G9 52.79,112.67 | 52.79,112.67 53.02,112.67 | DE9FEMALE1.G9 52.79,112.67 | 52.79,112.67 53.02,112.67 | DE9FEMALE1.G9 52.79,112.67
  Bottom 0.61: 23.02,112.67 23.26,112.67 DE9FEMALE1.G10 | DE9FEMALE1.G3 23.02,110.17 23.1,110.25 23.36,110.25 DE9FEMALE1.G10 | DE9FEMALE1.G4 25.98,109.91 25,110.89 24.37,110.25 24.52,110.4 DE9FEMALE1.G10 | 26.02,112.67 25.79,112.67 DE9FEMALE1.G10 | 51.04,112.67 50.02,112.67 | 50.02,112.67 49.77,112.67 50.02,112.67 | 50.02,112.67 51.04,112.67 | 53.02,112.67 51.04,112.67 | DE9FEMALE1.G9 DE9FEMALE1.G7 | DE9FEMALE1.G9 DE9FEMALE1.G8 | DE9FEMALE1.G9 51.52,112.19 51.04,112.67 | DE9FEMALE1.G9 51.29,111.41 50.02,112.67
  pour Top: 0.11,114.06 28.18,114.06 28.18,107.71 47.99,107.71 47.99,113.81 107.55,113.81 107.55,0.01 51.93,0.01 50.79,1.16 50.79,1.92 26.66,1.92 26.66,1.16 25.51,0.01 -0.01,0.01 -0.01,113.93
KC1  (via drill 0.35)
  Top 0.305: D33.C 7.99,31 64.25,31 v66.28,28.97
  Bottom 0.305: D19.C 5.57,82.74 2.41,79.57 2.41,75.5 5.57,72.34 D24.C 5.57,63.69 2.41,60.52 2.41,51.18 D29.C 5.7,44.76 2.41,41.47 2.41,37.4 5.7,34.11 D33.C | v66.28,28.97 67.42,27.83 67.42,12.71 68.69,11.44 97.39,11.44 99.05,13.1 99.05,28.6 JP2.8
KC2  (via drill 0.35)
  Top 0.305: v63.74,30.24 26.4,30.24 D34.C
  Bottom 0.305: D34.C 24.75,34.11 21.46,37.4 21.46,41.47 24.75,44.76 24.75,47.77 D30.C 24.62,53.29 21.46,56.45 21.46,63.65 D25.C 24.75,72.21 21.46,75.5 21.46,79.57 24.75,82.86 D20.C | JP2.9 99.55,26.56 99.55,12.84 97.65,10.94 68.44,10.94 66.97,12.41 66.97,27.4 66.07,28.29 66,28.29 65.6,28.69 65.6,28.76 64.12,30.24 v63.74,30.24
KC3  (via drill 0.35)
  Top 0.305: D35.C 47.23,25.16 52.77,25.16 53.8,26.19 55.39,26.19 56.42,25.16 v66.28,25.16
  Bottom 0.305: D21.C 44.56,83.62 40.51,79.57 40.51,75.5 44.56,71.45 44.56,67.58 D26.C 43.8,63.81 40.51,60.52 40.51,56.45 43.8,53.16 D31.C 43.8,44.76 40.51,41.47 40.51,31.88 D35.C | JP2.10 100.01,24.48 100.01,12.65 97.84,10.48 68.25,10.48 66.28,12.45 v66.28,25.16
KC4
  Bottom 0.305: D36.C 62.85,28.97 | 62.85,28.97 62.85,34.11 59.56,37.4 59.56,41.47 62.85,44.76 D32.C 62.85,53.16 59.56,56.45 59.56,60.52 62.85,63.81 62.85,66.82 D27.C 62.72,72.34 59.56,75.5 59.56,82.7 D22.C | JP2.11 100.57,22.5 100.57,12.46 98.03,9.92 68.06,9.92 65.52,12.46 65.52,26.3 62.85,28.97
KC5
  Bottom 0.305: D23.C 21.09,9.41 22.33,8.17 22.69,8.17 22.72,8.14 52.06,8.14 52.69,8.78 | 52.69,8.78 D28.C | 52.69,8.78 53.07,9.16 D28.C | JP2.12 101.08,20.47 101.08,12.29 98.2,9.41 D28.C
KR1
  Top 0.305: S_D1.S2 22.96,97.41 22.64,97.41 21.46,96.23 21.46,94.55 24.38,91.63 30.38,91.63 33.35,88.66 33.35,86.85 33.53,86.67 33.6,86.67 34.91,85.36 41.96,85.36 43.45,86.85 43.45,87.04 45.02,88.61 45.02,90.86 46.34,92.18 52.34,92.18 54.71,94.55 54.71,97.35 | S_E1.S2 45.69,99.85 52.22,99.85 54.71,97.35 | 54.71,97.35 60.68,97.35 60.74,97.41 61.06,97.41 S_F1.S2 65.01,101.36 71.36,101.36 75.17,97.55 75.17,44.21 76.35,43.03 JP4.9 | S_C1.S2 3.91,97.41 3.59,97.41 2.4,96.22 2.4,77.82 1.95,77.37 1.95,75.31 2.4,74.87 2.4,58.77 1.95,58.32 1.95,56.26 2.4,55.82 2.4,39.71 1.95,39.27 1.95,37.21 2.4,36.77 2.4,27.45 5.57,24.27 S_ENTER1.S2
  Top 0.406: S_C1.S2 S_D1.S2
KR2  (1 unrouted)
  Top 0.305: S_10.S2 7.1,81.42 | 7.1,81.42 S_18.S2 S_A1.S2 63.74,81.42 | 63.74,81.42 64.63,81.42 65.01,81.04 | 7.1,81.42 5.32,81.42 3.29,79.39 3.29,78.06 2.41,77.18 2.41,75.5 3.29,74.62 3.29,59.01 2.41,58.13 2.41,56.45 3.29,55.57 2.86,55.14 2.86,39.53 2.41,39.08 2.41,37.4 2.86,36.96 2.86,28.89 5.32,26.43 18.02,26.43 20.18,24.27 S_BACK1.S2 | JP4.7 76.35,37.95 74.71,39.59 74.71,78.96 72.25,81.42 63.74,81.42
KR3
  Top 0.305: S_14.S2 S_17.S2 S_16.S2 63.74,62.37 | 63.74,62.37 S_13.S2 | JP4.6 77.62,35.41 74.26,38.77 74.26,60.36 72.25,62.37 63.74,62.37
KR4
  Top 0.305: S_11.S2 S_19.S2 S_15.S2 S_12.S2 64.63,43.32 | 64.63,43.32 65.01,42.94 | JP4.5 79.51,32.87 73.8,38.59 73.8,41.67 72.15,43.32 64.63,43.32
N$1
  Bottom 0.305: D33.A 13.32,34.11 16.61,37.4 16.61,39.08 15.43,40.26 13.84,40.26 S_11.S1
N$2
  Bottom 0.305: D34.A 32.37,34.11 35.66,37.4 35.66,39.08 34.48,40.26 32.89,40.26 S_19.S1
N$3  (1 unrouted)
  Bottom 0.305: D35.A 51.04,28.97 51.04,33.73 54.71,37.4 54.71,39.08 53.53,40.26 51.18,40.26 51.04,40.4
N$4  (1 unrouted)
  Bottom 0.305: D36.A 70.47,34.11 73.76,37.4 73.76,39.08 72.58,40.26 71.5,40.26 71.36,40.4
N$23
  Bottom 0.305: D29.A 13.32,53.16 16.61,56.45 16.61,58.13 15.43,59.31 14.35,59.31 13.83,59.83 S_14.S1
N$24  (1 unrouted)
  Bottom 0.305: D30.A 32.24,53.03 35.66,56.45 35.66,58.13 34.48,59.31 33.4,59.31 31.99,60.72
N$25
  Bottom 0.305: D31.A 51.42,53.16 54.71,56.45 54.71,58.13 53.53,59.31 51.94,59.31 S_16.S1
N$26  (1 unrouted)
  Bottom 0.305: D32.A 70.09,48.27 70.09,52.78 73.76,56.45 73.76,58.13 72.58,59.31 70.23,59.31 70.09,59.45
N$27
  Bottom 0.305: D24.A 13.19,72.09 16.61,75.5 16.61,77.18 15.43,78.36 14.35,78.36 13.83,78.88 S_10.S1
N$28
  Bottom 0.305: D25.A 32.37,72.21 35.66,75.5 35.66,77.18 34.48,78.36 32.8,78.36 32.56,78.12 32.37,78.12 31.99,78.5 S_18.S1
N$29
  Bottom 0.305: D26.A 51.42,72.21 54.71,75.5 54.71,77.18 53.53,78.36 51.94,78.36 S_A1.S1
N$30
  Bottom 0.305: S_B1.S1 70.34,78.75 70.73,78.36 72.58,78.36 73.76,77.18 73.76,75.5 70.34,72.09 D27.A
N$31
  Bottom 0.305: D28.A 60.95,15.06 64.24,18.35 64.24,20.03 63.05,21.21 61.46,21.21 S_BACK1.S1
N$32
  Bottom 0.305: D23.A 22.85,15.06 26.14,18.35 26.14,20.03 24.95,21.21 23.36,21.21 S_ENTER1.S1
N$33
  Bottom 0.305: D22.A 70.47,91.26 73.76,94.55 73.76,96.23 72.58,97.41 70.99,97.41 S_F1.S1
N$34  (1 unrouted)
  Bottom 0.305: 52.31,97.55 52.18,97.42 52.19,97.41 53.53,97.41 54.71,96.23 54.71,94.55 52.18,92.02 D21.A
N$35
  Bottom 0.305: D20.A 32.37,91.26 35.66,94.55 35.66,96.23 34.48,97.41 32.89,97.41 S_D1.S1
N$36  (1 unrouted)
  Bottom 0.305: 14.21,98.82 13.19,97.8 13.59,97.41 15.43,97.41 16.61,96.23 16.61,94.55 13.19,91.14 D19.A
N$50  (via drill 0.35)
  Top 0.305: U1.3 40.31,91.39 v40.5,91.2 | v40.63,101.87 42.15,100.34 42.15,98.07 C1.2
  Bottom 0.305: v40.5,91.2 40.5,101.49 40.63,101.61 v40.63,101.87
N$51
  Top 0.305: C1.1 43.75,97.09 44.56,96.28 44.56,93.49 44.18,93.11 42.92,93.11 U1.1
N$52
  Top 0.406: U1.4 39.04,96.21 C2.1
N$53
  Top 0.406: U1.5 37.77,95.95 C2.2
N$54
  Top 0.305: C3.1 41.08,96.8 40.51,96.23 40.51,94.55 41.58,93.48 U1.2
N$55
  Top 0.406: C4.1 36.44,98.43 36.44,93.24 U1.6
N$56  (via drill 0.35)
  Top 0.305: DE9FEMALE1.P5 33.39,106.19 v33.39,104.66 | DE9FEMALE1.P2 40.76,104.54 v40.75,104.54
  Bottom 0.305: DE9FEMALE1.P9 33.39,106.51 v33.39,104.66 33.51,104.54 v40.75,104.54
N$57  (2 unrouted)
N$58  (2 unrouted)
N$59  (2 unrouted)
N$60  (1 unrouted)
N$61  (1 unrouted)
N$62
  Top 0.406: R42.2 A9.1
N$63
  Top 0.406: R43.2 A10.1
N$64  (via drill 0.35)
  Top 0.305: HT16K1.P$22 93.71,84.2 93.71,85.16 93.77,85.22 93.77,85.79 93.71,85.85 v93.71,90.31 | U$11.7 88,81.67 88,85.2 87.95,85.25 87.95,86.78 88,86.83 88,88.58 87.83,88.75 87.83,89.32 88,89.48 v88,89.8
  Bottom 0.305: v93.71,90.31 92.52,90.31 91.96,89.76 91.4,89.76 91.35,89.8 v88,89.8
N$65  (via drill 0.35)
  Top 0.305: U$11.1 103.3,86.95 v103.36,87.01 | HT16K1.P$21 92.46,85.18 92.41,85.22 92.41,85.79 92.44,85.82 v92.44,87.52
  Bottom 0.305: v103.36,87.01 96.2,87.01 95.96,87.26 92.7,87.26 v92.44,87.52
N$66  (1 unrouted)
N$67
  Top 0.305: HT16K1.P$19 89.92,91.19 89.3,91.81 89.3,95.55 U$11.13
N$68
  Top 0.305: HT16K1.P$18 88.65,82.8 89.84,81.61 U$11.6
N$69
  Top 0.406: D2.C 84.23,130.57 R43.1 R42.1 R44.1
N$70
  Top 0.406: R44.2 A11.1
N$71  (via drill 0.35)
  Top 0.305: U$11.17 100.76,95.4 100.72,95.36 100.72,92.62 v100.57,92.47 | HT16K1.P$17 87.31,84.25 87.31,90.09 87.54,90.31 87.54,90.98 87.36,91.15 v87.36,92.34
  Bottom 0.305: v100.57,92.47 100.44,92.34 v87.36,92.34
N$72  (via drill 0.35)
  Top 0.305: U$11.15 95.68,95.4 95.64,95.36 95.64,93.33 95.67,93.3 95.67,92.09 95.57,91.99 95.57,91.43 95.67,91.32 v95.67,86.57 | HT16K1.P$16 86.11,86.19 86.14,86.22 86.14,87.22 v86.09,87.26
  Bottom 0.305: v86.09,87.26 86.78,86.57 87.74,86.57 88.35,87.18 88.91,87.18 89.45,86.65 93.56,86.65 93.64,86.57 v95.67,86.57
N$73  (via drill 0.35)
  Top 0.305: U$11.14 93.14,95.4 93.1,95.36 93.1,90.67 93.03,90.59 93.03,90.03 93.12,89.93 93.12,87.23 93.09,87.2 v93.09,85.51 | v83.81,84.22 84.81,84.22 HT16K1.P$15
  Bottom 0.305: v93.09,85.51 89.25,85.51 88.94,85.2 86.21,85.2 86.05,85.36 84.95,85.36 v83.81,84.22
N$74  (via drill 0.35)
  Top 0.305: HT16K1.P$14 84.84,94.25 84.44,94.25 v83.93,93.74 | U$11.2 100.76,83.13 100.72,83.17 100.72,91.66 101.25,92.19 101.25,92.54 v102.19,93.49
  Bottom 0.305: v102.19,93.49 84.19,93.49 v83.93,93.74
N$75  (via drill 0.35)
  Top 0.305: HT16K1.P$13 86.11,91.47 v86.09,91.45 | v96.38,91.58 96.38,87.14 96.93,86.58 96.93,85.58 96.89,85.54 | 96.89,85.23 96.89,85.54 | 96.89,85.54 96.89,85.2 96.89,82.82 U$11.4
  Bottom 0.305: v96.38,91.58 96.12,91.84 86.09,91.84 v86.09,91.45
N$76  (via drill 0.35)
  Top 0.305: v91.68,90.44 91.68,85.33 91.81,85.2 91.81,82.94 U$11.5 | v86.85,90.69 86.85,91.76 86.68,91.93 86.68,92.8 87.38,93.5 HT16K1.P$12
  Bottom 0.305: v91.68,90.44 88.33,90.44 88.28,90.49 87.06,90.49 v86.85,90.69
N$77  (via drill 0.35)
  Top 0.305: U$11.8 85.52,83.13 85.48,83.17 85.48,86.47 v85.46,86.5 | HT16K1.P$11 88.65,90.77 89.2,90.22 89.2,88.75 88.63,88.19 v88.63,86.5
  Bottom 0.305: v85.46,86.5 86.21,86.5 86.59,86.12 88.14,86.12 88.52,86.5 v88.63,86.5
RM102-1
  Top 0.305: IC1.7 92.7,67.18 92.7,65.8 92.31,65.42 87.49,65.42 86.52,64.45 86.52,43.66 92.11,38.06 94.54,38.06 98.16,34.44 98.16,21.63 U$18.1
RM102-2  (via drill 0.35)
  Top 0.305: U$18.2 97.47,22.9 v97.47,28.72 | v98.84,30.88 98.61,31.1 98.61,34.63 94.73,38.52 92.3,38.52 86.97,43.85 86.97,64.26 87.68,64.96 93.51,64.96 94.09,65.55 94.09,67.19 IC1.8
  Bottom 0.305: v97.47,28.72 98.84,30.08 v98.84,30.88
RM103-1  (via drill 0.35)
  Top 0.305: IC1.1 v85.14,32.27 | U$17.1 94.98,34.97 94.98,36.97 94.35,37.61 89.85,37.61 v89.65,37.4
  Bottom 0.305: v89.65,37.4 89.65,36.77 v85.14,32.27
RM103-2  (via drill 0.35)  (1 unrouted)
  Top 0.305: IC1.2 86.41,66.25 85.6,65.44 85.6,34.05 | v85.83,34.3 85.6,34.08 | U$17.2 92.22,36.72 88.24,36.72 v87.73,36.21
  Bottom 0.305: v87.73,36.21 v85.83,34.3
RM103-3
  Top 0.305: IC1.3 87.68,66.5 86.06,64.88 86.06,35.45 86.69,34.81 91.59,34.81 U$17.3
RM107-1  (via drill 0.35)
  Top 0.305: U$12.1 90.22,57.23 89.32,58.13 89.32,61.91 91.25,63.84 104.93,63.84 105.16,64.07 105.72,64.07 106.12,63.67 106.12,63.1 105.66,62.65 v105.66,62.37 | v92.7,72.95 92.7,76.74 IC1.22
  Bottom 0.305: v105.66,62.37 106.12,62.83 106.12,63.67 105.9,63.9 105.9,69.31 102.47,72.73 92.92,72.73 v92.7,72.95
RM107-2  (via drill 0.35)
  Top 0.305: IC1.23 91.49,72.46 v91.68,72.27 | U$12.2 89.77,60.08 89.77,61.61 91.55,63.39 v105.44,63.39
  Bottom 0.305: v91.68,72.27 102.28,72.27 105.44,69.12 v105.44,63.39
RM107-3  (via drill 0.35)
  Top 0.305: U$12.3 91.62,62.18 92.02,62.58 96.68,62.58 97.27,61.99 103.61,61.99 103.79,62.16 104.42,62.16 v104.75,62.5 | v90.28,71.81 90.28,76.75 IC1.24
  Bottom 0.305: v104.75,62.5 104.75,69.15 102.32,71.59 90.51,71.59 v90.28,71.81
RM107-4  (via drill 0.35)
  Top 0.305: IC1.25 88.95,71.19 v89.01,71.13 | v104.07,61.48 97.01,61.48 96.76,61.74 93.58,61.74 U$12.4
  Bottom 0.305: v89.01,71.13 102.13,71.13 104.07,69.19 v104.07,61.48
RM107-5  (via drill 0.35)
  Top 0.305: U$12.5 103.55,60.66 v103.61,60.59 | v87.74,70.67 87.68,70.73 IC1.26
  Bottom 0.305: v103.61,60.59 103.39,60.82 103.39,69.23 102.17,70.45 87.97,70.45 v87.74,70.67
RM107-6  (via drill 0.35)
  Top 0.305: IC1.27 86.41,70.06 v86.35,69.99 | v103.16,58.94 96,58.94 U$12.6
  Bottom 0.305: v86.35,69.99 101.98,69.99 102.93,69.04 102.93,59.17 v103.16,58.94
RM107-7  (via drill 0.35)
  Top 0.305: IC1.28 85.14,69.3 v85.08,69.23
  Bottom 0.305: v85.08,69.23 102.09,69.23 102.47,68.85 102.47,57.42 101.97,56.91 95.49,56.91 U$12.7
RXD
  Top 0.305: U1.13 38.37,88.24 38.37,89.97 35.89,92.45 35.89,97.54 34.51,98.92 34.51,100.37 38.02,103.88 DE9FEMALE1.P3
SCL  (via drill 0.35)  (1 unrouted)
  Top 0.305: JP4.11 76.6,48.11 75.63,49.09 75.63,77.81 76.69,78.88 95.87,78.88 | 95.87,78.88 96.89,78.88 96.89,81.9 98.16,83.17 98.16,83.54 HT16K1.P$26 | IC1.12 99.11,70.19 103.87,74.94 103.87,78.5 103.36,79.01 v99.68,79.01 | v95.87,79.52 95.87,78.88
  Bottom 0.305: v99.68,79.01 96.38,79.01 v95.87,79.52
SDA  (1 unrouted)
  Top 0.305: HT16K1.P$27 100.08,82.71 99.55,82.18 99.55,80.9 98.48,79.83 | 98.48,79.83 97.08,78.42 76.88,78.42 76.08,77.62 76.08,51.8 77.24,50.65 JP4.12 | IC1.13 100.38,70.31 104.51,74.44 104.51,78.88 103.56,79.83 98.48,79.83
TXD  (via drill 0.35)
  Top 0.305: U1.14 39.64,88.24 39.64,88.3 39.61,88.34 v39.61,89.42 | v35.42,103.65 35.42,106.9 DE9FEMALE1.P4
  Bottom 0.305: v39.61,89.42 37.45,89.42 35.93,90.95 35.93,94.17 36.12,94.36 36.12,96.42 35.93,96.61 35.93,103.14 v35.42,103.65
UART_RX  (via drill 0.35)
  Top 0.305: U1.12 37.83,87.51 v37.83,86.04 | 38.34,9.92 v38.34,9.67 39.99,8.02 101.84,8.02 104.76,10.94 104.76,44.72 103.83,45.65 JP2.3
  Bottom 0.305: v37.83,86.04 37.83,10.17 v38.34,9.67
UART_TX  (via drill 0.35)
  Top 0.305: U1.11 36.5,86.1 v36.56,86.04 | 37.07,9.92 v37.07,9.54 39.05,7.56 102.03,7.56 105.27,10.8 105.27,46.32 JP2.2
  Bottom 0.305: v37.07,9.54 36.56,10.05 v36.56,86.04
VCC  (8 unrouted)
  Top 0.61: R39.2 R38.2 | A8.2 A7.2 A6.2
  pour Bottom: 0.24,114.06 28.18,114.06 28.18,108.34 47.87,108.34 47.87,113.81 107.55,113.81 107.55,0.01 51.93,0.01 50.79,1.16 50.79,1.79 50.66,1.92 26.66,1.92 26.66,1.41 25.26,0.01 0.11,0.01 0.11,113.93

### Text on the board
tPlace: A0 | A1 | 0x70 Defualt | A2 | A2 | A1 | A0 | 0x20 Default | RM107 | RM103 | RM102